# EAGLE design I2CRJ45X24PT (EAGLE 9.6.0)

## Sheet 1 of 4
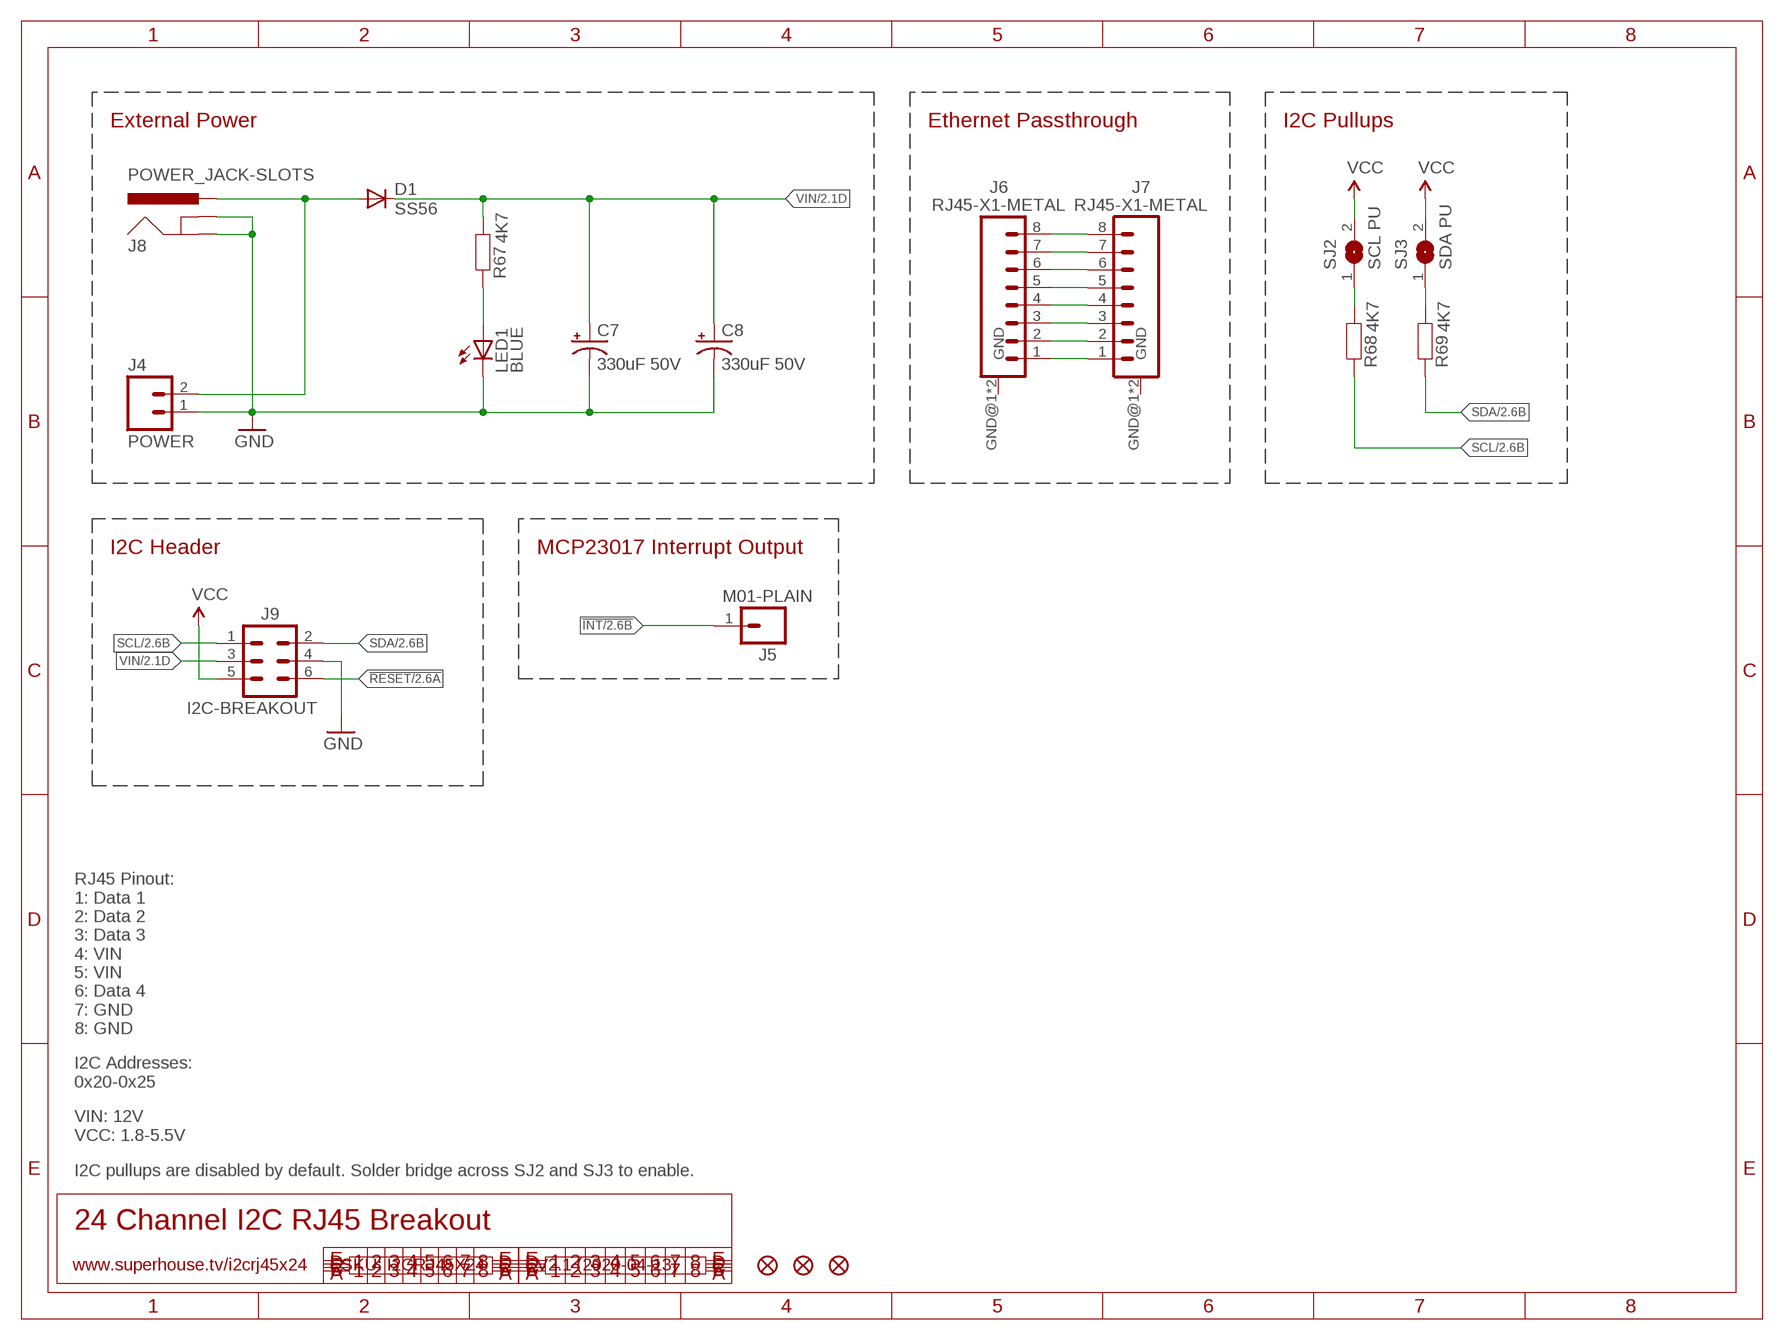
[diagram p0: schematic, sheet 1]

### Parts
C7  330uF 50V  CAP_POLG  [PANASONIC_G]
C8  330uF 50V  CAP_POLG  [PANASONIC_G]
D1  SS56  DIODESMA  [SMA-DIODE]
FID1  FIDUCIAL1X2.5  [FIDUCIAL-1X2.5]
FID2  FIDUCIAL1X2.5  [FIDUCIAL-1X2.5]
FID3  FIDUCIAL1X2.5  [FIDUCIAL-1X2.5]
J4  POWER  M02-SCREW-3.5MM  [SCREWTERMINAL-3.5MM-2]
J5  M01-PLAIN  [1X01]
J6  RJ45-X1-METAL  [RJ45-1X1]
J7  RJ45-X1-METAL  [RJ45-1X1]
J8  POWER_JACK-SLOTS  [POWER_JACK_SLOTS]
J9  I2C-BREAKOUT  M02X3-SHROUDED  [2X03-SHROUDED]
LED1  BLUE  LED3MM  [LED3MM]
R67  4K7  RESISTOR0603  [R0603]
R68  4K7  RESISTOR0603  [R0603]
R69  4K7  RESISTOR0603  [R0603]
SJ2  SCL PU  SJ-NORMAL  [SJ]
SJ3  SDA PU  SJ-NORMAL  [SJ]

### Nets
!INT: J5.1 ; also sheet 2,3,4
!RESET: J9.6 ; also sheet 2,3,4
GND: C7.- C8.- J4.1 J8.GND J8.GNDBREAK J9.4 LED1.K(C) ; also sheet 2,3,4
N$1: R68.2 SJ2.1
N$2: R69.2 SJ3.1
N$3: J6.1 J7.1
N$4: J6.2 J7.2
N$5: J6.3 J7.3
N$6: J6.4 J7.4
N$9: J6.5 J7.5
N$10: J6.6 J7.6
N$11: J6.7 J7.7
N$12: J6.8 J7.8
N$13: LED1.A R67.1
N$18: D1.A J4.2 J8.PWR
SCL: J9.1 R68.1 ; also sheet 2,3,4
SDA: J9.2 R69.1 ; also sheet 2,3,4
VCC: J9.5 SJ2.2 SJ3.2 ; also sheet 2,3,4
VIN: C7.+ C8.+ D1.C J9.3 R67.2 ; also sheet 2,3,4
Unconnected: J6.GND@1(GND) J6.GND@2(GND) J7.GND@1(GND) J7.GND@2(GND)

### Notes on the sheet
- External Power | Ethernet Passthrough | I2C Pullups
- I2C Header | MCP23017 Interrupt Output
- RJ45 Pinout:
  1: Data 1
  2: Data 2
  3: Data 3
  4: VIN
  5: VIN
  6: Data 4
  7: GND
  8: GND
- I2C Addresses:
  0x20-0x25
- VIN: 12V
  VCC: 1.8-5.5V
- I2C pullups are disabled by default. Solder bridge across SJ2 and SJ3 to enable.
- 24 Channel I2C RJ45 Breakout
- www.superhouse.tv/i2crj45x24 | SKU: I2CRJ45X24 | V2.1 (2020-04-13)

## Sheet 2 of 4
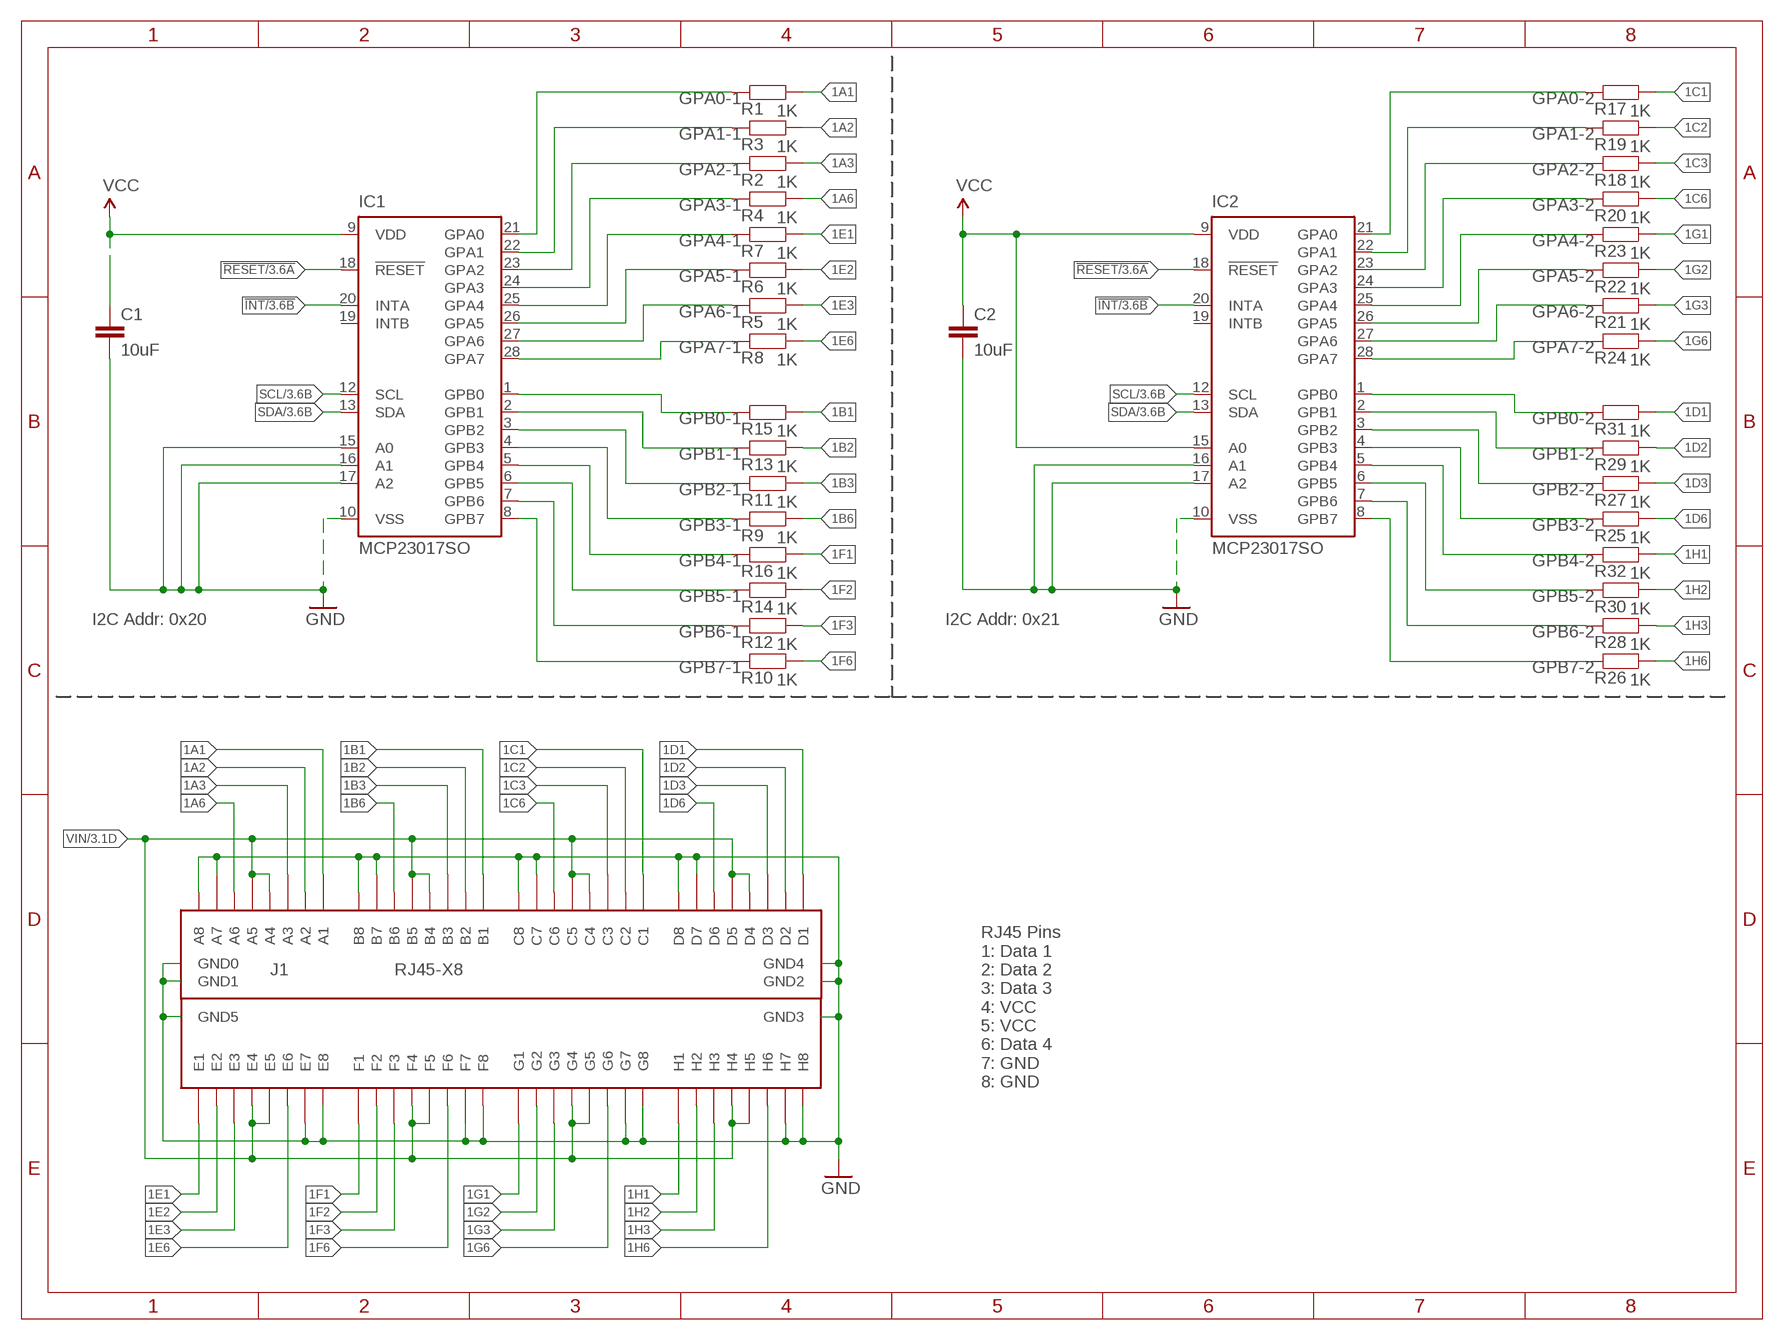
[diagram p1: schematic, sheet 2]

### Parts
C1  10uF  CAP0805  [C0805]
C2  10uF  CAP0805  [C0805]
IC1  MCP23017SO  [SO28W]
IC2  MCP23017SO  [SO28W]
J1  RJ45-X8  [RJ45-2X4]
R1  1K  RESISTOR0603  [R0603]
R2  1K  RESISTOR0603  [R0603]
R3  1K  RESISTOR0603  [R0603]
R4  1K  RESISTOR0603  [R0603]
R5  1K  RESISTOR0603  [R0603]
R6  1K  RESISTOR0603  [R0603]
R7  1K  RESISTOR0603  [R0603]
R8  1K  RESISTOR0603  [R0603]
R9  1K  RESISTOR0603  [R0603]
R10  1K  RESISTOR0603  [R0603]
R11  1K  RESISTOR0603  [R0603]
R12  1K  RESISTOR0603  [R0603]
R13  1K  RESISTOR0603  [R0603]
R14  1K  RESISTOR0603  [R0603]
R15  1K  RESISTOR0603  [R0603]
R16  1K  RESISTOR0603  [R0603]
R17  1K  RESISTOR0603  [R0603]
R18  1K  RESISTOR0603  [R0603]
R19  1K  RESISTOR0603  [R0603]
R20  1K  RESISTOR0603  [R0603]
R21  1K  RESISTOR0603  [R0603]
R22  1K  RESISTOR0603  [R0603]
R23  1K  RESISTOR0603  [R0603]
R24  1K  RESISTOR0603  [R0603]
R25  1K  RESISTOR0603  [R0603]
R26  1K  RESISTOR0603  [R0603]
R27  1K  RESISTOR0603  [R0603]
R28  1K  RESISTOR0603  [R0603]
R29  1K  RESISTOR0603  [R0603]
R30  1K  RESISTOR0603  [R0603]
R31  1K  RESISTOR0603  [R0603]
R32  1K  RESISTOR0603  [R0603]

### Nets
1A1: J1.A1 R1.2
1A2: J1.A2 R3.2
1A3: J1.A3 R2.2
1A6: J1.A6 R4.2
1B1: J1.B1 R15.2
1B2: J1.B2 R13.2
1B3: J1.B3 R11.2
1B6: J1.B6 R9.2
1C1: J1.C1 R17.2
1C2: J1.C2 R19.2
1C3: J1.C3 R18.2
1C6: J1.C6 R20.2
1D1: J1.D1 R31.2
1D2: J1.D2 R29.2
1D3: J1.D3 R27.2
1D6: J1.D6 R25.2
1E1: J1.E1 R7.2
1E2: J1.E2 R6.2
1E3: J1.E3 R5.2
1E6: J1.E6 R8.2
1F1: J1.F1 R16.2
1F2: J1.F2 R14.2
1F3: J1.F3 R12.2
1F6: J1.F6 R10.2
1G1: J1.G1 R23.2
1G2: J1.G2 R22.2
1G3: J1.G3 R21.2
1G6: J1.G6 R24.2
1H1: J1.H1 R32.2
1H2: J1.H2 R30.2
1H3: J1.H3 R28.2
1H6: J1.H6 R26.2
!INT: IC1.20(INTA) IC2.20(INTA) ; also sheet 1,3,4
!RESET: IC1.18(!RESET) IC2.18(!RESET) ; also sheet 1,3,4
GND: C1.2 C2.2 IC1.10(VSS) IC1.15(A0) IC1.16(A1) IC1.17(A2) IC2.10(VSS) IC2.16(A1) IC2.17(A2) J1.A7 J1.A8 J1.B7 J1.B8 J1.C7 J1.C8 J1.D7 J1.D8 J1.E7 J1.E8 J1.F7 J1.F8 J1.G7 J1.G8 J1.GND0 J1.GND1 J1.GND2 J1.GND3 J1.GND4 J1.GND5 J1.H7 J1.H8 ; also sheet 1,3,4
GPA0-1: IC1.21(GPA0) R1.1
GPA0-2: IC2.21(GPA0) R17.1
GPA1-1: IC1.22(GPA1) R3.1
GPA1-2: IC2.22(GPA1) R19.1
GPA2-1: IC1.23(GPA2) R2.1
GPA2-2: IC2.23(GPA2) R18.1
GPA3-1: IC1.24(GPA3) R4.1
GPA3-2: IC2.24(GPA3) R20.1
GPA4-1: IC1.25(GPA4) R7.1
GPA4-2: IC2.25(GPA4) R23.1
GPA5-1: IC1.26(GPA5) R6.1
GPA5-2: IC2.26(GPA5) R22.1
GPA6-1: IC1.27(GPA6) R5.1
GPA6-2: IC2.27(GPA6) R21.1
GPA7-1: IC1.28(GPA7) R8.1
GPA7-2: IC2.28(GPA7) R24.1
GPB0-1: IC1.1(GPB0) R15.1
GPB0-2: IC2.1(GPB0) R31.1
GPB1-1: IC1.2(GPB1) R13.1
GPB1-2: IC2.2(GPB1) R29.1
GPB2-1: IC1.3(GPB2) R11.1
GPB2-2: IC2.3(GPB2) R27.1
GPB3-1: IC1.4(GPB3) R9.1
GPB3-2: IC2.4(GPB3) R25.1
GPB4-1: IC1.5(GPB4) R16.1
GPB4-2: IC2.5(GPB4) R32.1
GPB5-1: IC1.6(GPB5) R14.1
GPB5-2: IC2.6(GPB5) R30.1
GPB6-1: IC1.7(GPB6) R12.1
GPB6-2: IC2.7(GPB6) R28.1
GPB7-1: IC1.8(GPB7) R10.1
GPB7-2: IC2.8(GPB7) R26.1
SCL: IC1.12(SCL) IC2.12(SCL) ; also sheet 1,3,4
SDA: IC1.13(SDA) IC2.13(SDA) ; also sheet 1,3,4
VCC: C1.1 C2.1 IC1.9(VDD) IC2.9(VDD) IC2.15(A0) ; also sheet 1,3,4
VIN: J1.A4 J1.A5 J1.B4 J1.B5 J1.C4 J1.C5 J1.D4 J1.D5 J1.E4 J1.E5 J1.F4 J1.F5 J1.G4 J1.G5 J1.H4 J1.H5 ; also sheet 1,3,4
Unconnected: IC1.19(INTB) IC2.19(INTB)

### Notes on the sheet
- I2C Addr: 0x20 | I2C Addr: 0x21
- RJ45 Pins
  1: Data 1
  2: Data 2
  3: Data 3
  4: VCC
  5: VCC
  6: Data 4
  7: GND
  8: GND

## Sheet 3 of 4
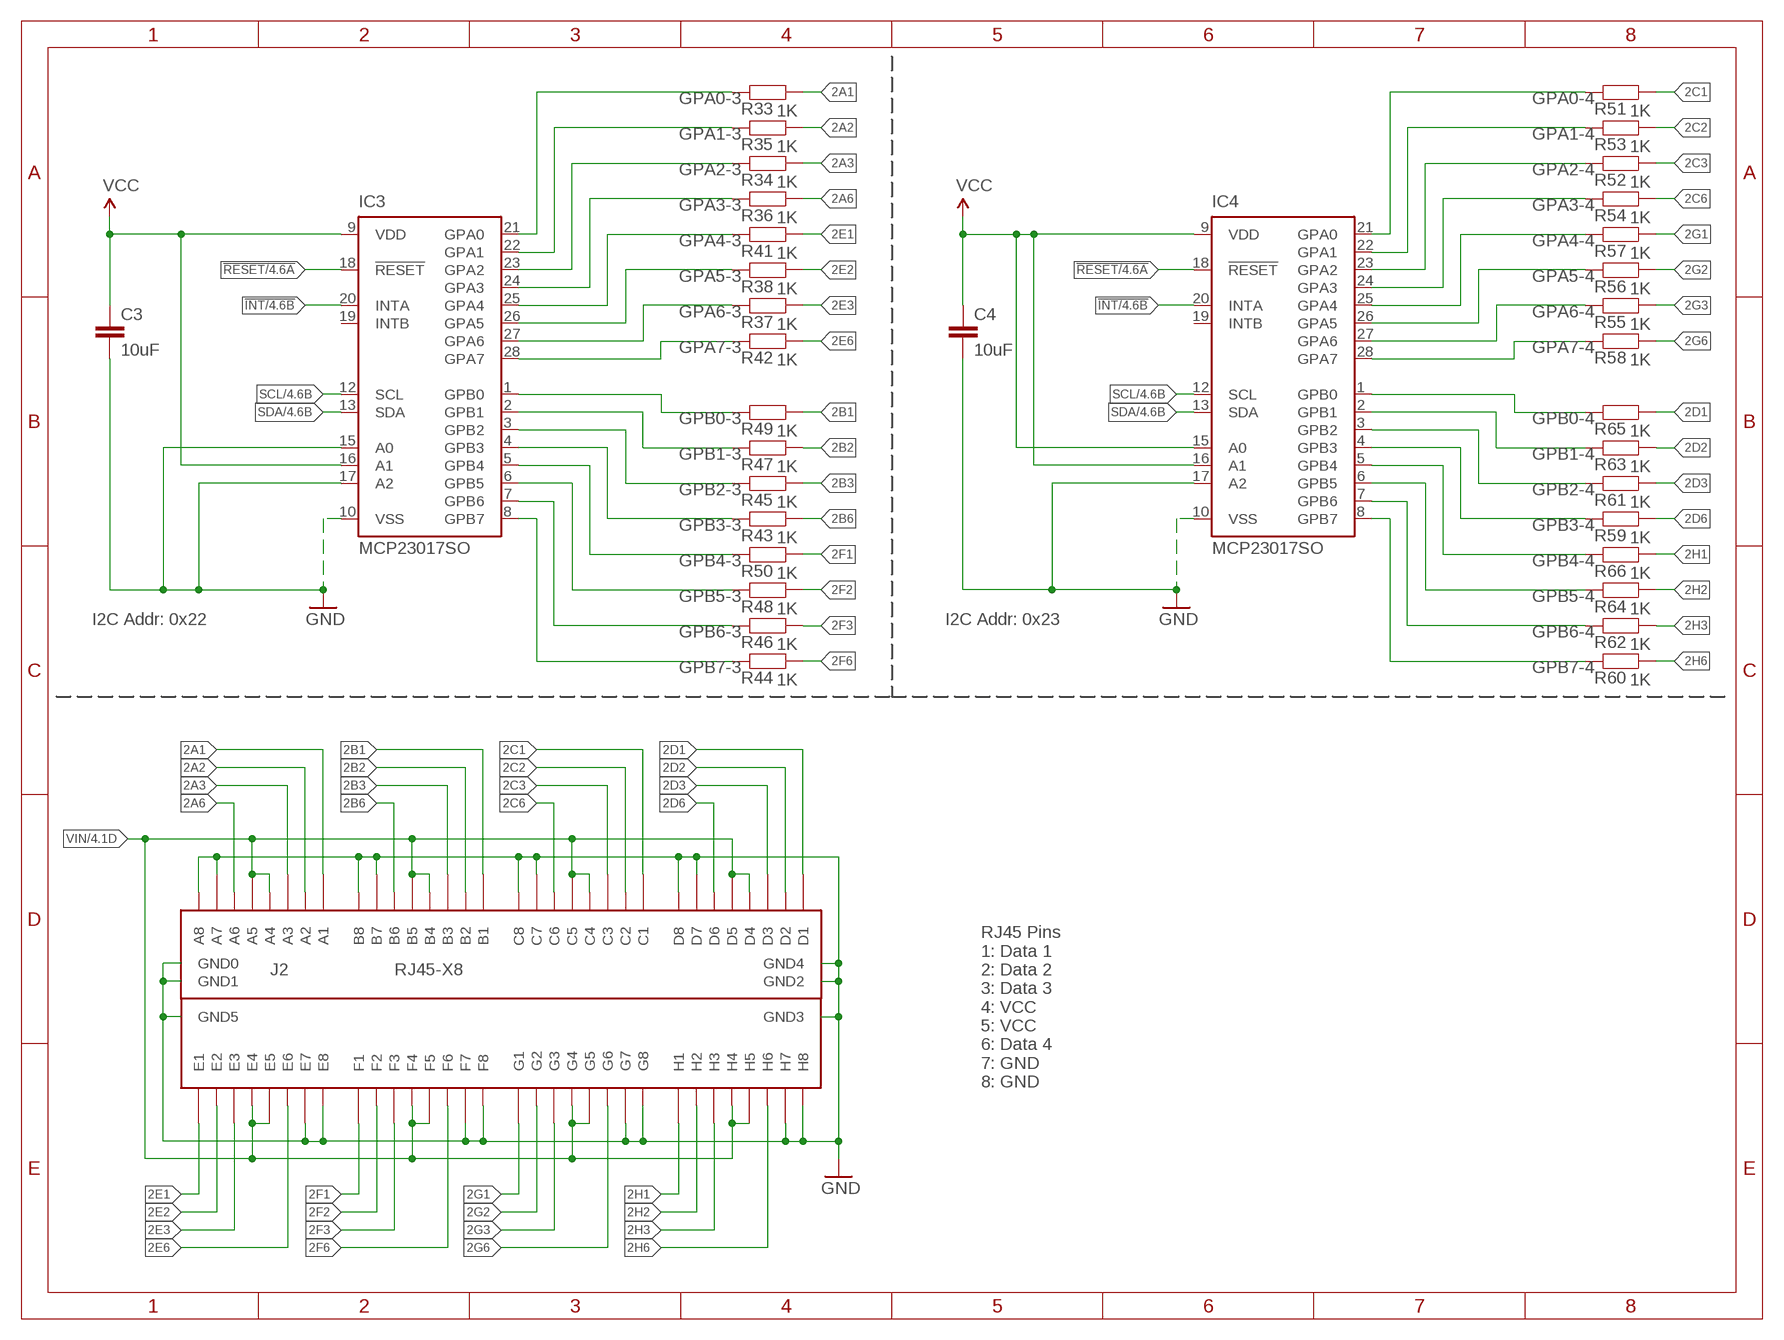
[diagram p2: schematic, sheet 3]

### Parts
C3  10uF  CAP0805  [C0805]
C4  10uF  CAP0805  [C0805]
IC3  MCP23017SO  [SO28W]
IC4  MCP23017SO  [SO28W]
J2  RJ45-X8  [RJ45-2X4]
R33  1K  RESISTOR0603  [R0603]
R34  1K  RESISTOR0603  [R0603]
R35  1K  RESISTOR0603  [R0603]
R36  1K  RESISTOR0603  [R0603]
R37  1K  RESISTOR0603  [R0603]
R38  1K  RESISTOR0603  [R0603]
R41  1K  RESISTOR0603  [R0603]
R42  1K  RESISTOR0603  [R0603]
R43  1K  RESISTOR0603  [R0603]
R44  1K  RESISTOR0603  [R0603]
R45  1K  RESISTOR0603  [R0603]
R46  1K  RESISTOR0603  [R0603]
R47  1K  RESISTOR0603  [R0603]
R48  1K  RESISTOR0603  [R0603]
R49  1K  RESISTOR0603  [R0603]
R50  1K  RESISTOR0603  [R0603]
R51  1K  RESISTOR0603  [R0603]
R52  1K  RESISTOR0603  [R0603]
R53  1K  RESISTOR0603  [R0603]
R54  1K  RESISTOR0603  [R0603]
R55  1K  RESISTOR0603  [R0603]
R56  1K  RESISTOR0603  [R0603]
R57  1K  RESISTOR0603  [R0603]
R58  1K  RESISTOR0603  [R0603]
R59  1K  RESISTOR0603  [R0603]
R60  1K  RESISTOR0603  [R0603]
R61  1K  RESISTOR0603  [R0603]
R62  1K  RESISTOR0603  [R0603]
R63  1K  RESISTOR0603  [R0603]
R64  1K  RESISTOR0603  [R0603]
R65  1K  RESISTOR0603  [R0603]
R66  1K  RESISTOR0603  [R0603]

### Nets
2A1: J2.A1 R33.2
2A2: J2.A2 R35.2
2A3: J2.A3 R34.2
2A6: J2.A6 R36.2
2B1: J2.B1 R49.2
2B2: J2.B2 R47.2
2B3: J2.B3 R45.2
2B6: J2.B6 R43.2
2C1: J2.C1 R51.2
2C2: J2.C2 R53.2
2C3: J2.C3 R52.2
2C6: J2.C6 R54.2
2D1: J2.D1 R65.2
2D2: J2.D2 R63.2
2D3: J2.D3 R61.2
2D6: J2.D6 R59.2
2E1: J2.E1 R41.2
2E2: J2.E2 R38.2
2E3: J2.E3 R37.2
2E6: J2.E6 R42.2
2F1: J2.F1 R50.2
2F2: J2.F2 R48.2
2F3: J2.F3 R46.2
2F6: J2.F6 R44.2
2G1: J2.G1 R57.2
2G2: J2.G2 R56.2
2G3: J2.G3 R55.2
2G6: J2.G6 R58.2
2H1: J2.H1 R66.2
2H2: J2.H2 R64.2
2H3: J2.H3 R62.2
2H6: J2.H6 R60.2
!INT: IC3.20(INTA) IC4.20(INTA) ; also sheet 1,2,4
!RESET: IC3.18(!RESET) IC4.18(!RESET) ; also sheet 1,2,4
GND: C3.2 C4.2 IC3.10(VSS) IC3.15(A0) IC3.17(A2) IC4.10(VSS) IC4.17(A2) J2.A7 J2.A8 J2.B7 J2.B8 J2.C7 J2.C8 J2.D7 J2.D8 J2.E7 J2.E8 J2.F7 J2.F8 J2.G7 J2.G8 J2.GND0 J2.GND1 J2.GND2 J2.GND3 J2.GND4 J2.GND5 J2.H7 J2.H8 ; also sheet 1,2,4
GPA0-3: IC3.21(GPA0) R33.1
GPA0-4: IC4.21(GPA0) R51.1
GPA1-3: IC3.22(GPA1) R35.1
GPA1-4: IC4.22(GPA1) R53.1
GPA2-3: IC3.23(GPA2) R34.1
GPA2-4: IC4.23(GPA2) R52.1
GPA3-3: IC3.24(GPA3) R36.1
GPA3-4: IC4.24(GPA3) R54.1
GPA4-3: IC3.25(GPA4) R41.1
GPA4-4: IC4.25(GPA4) R57.1
GPA5-3: IC3.26(GPA5) R38.1
GPA5-4: IC4.26(GPA5) R56.1
GPA6-3: IC3.27(GPA6) R37.1
GPA6-4: IC4.27(GPA6) R55.1
GPA7-3: IC3.28(GPA7) R42.1
GPA7-4: IC4.28(GPA7) R58.1
GPB0-3: IC3.1(GPB0) R49.1
GPB0-4: IC4.1(GPB0) R65.1
GPB1-3: IC3.2(GPB1) R47.1
GPB1-4: IC4.2(GPB1) R63.1
GPB2-3: IC3.3(GPB2) R45.1
GPB2-4: IC4.3(GPB2) R61.1
GPB3-3: IC3.4(GPB3) R43.1
GPB3-4: IC4.4(GPB3) R59.1
GPB4-3: IC3.5(GPB4) R50.1
GPB4-4: IC4.5(GPB4) R66.1
GPB5-3: IC3.6(GPB5) R48.1
GPB5-4: IC4.6(GPB5) R64.1
GPB6-3: IC3.7(GPB6) R46.1
GPB6-4: IC4.7(GPB6) R62.1
GPB7-3: IC3.8(GPB7) R44.1
GPB7-4: IC4.8(GPB7) R60.1
SCL: IC3.12(SCL) IC4.12(SCL) ; also sheet 1,2,4
SDA: IC3.13(SDA) IC4.13(SDA) ; also sheet 1,2,4
VCC: C3.1 C4.1 IC3.9(VDD) IC3.16(A1) IC4.9(VDD) IC4.15(A0) IC4.16(A1) ; also sheet 1,2,4
VIN: J2.A4 J2.A5 J2.B4 J2.B5 J2.C4 J2.C5 J2.D4 J2.D5 J2.E4 J2.E5 J2.F4 J2.F5 J2.G4 J2.G5 J2.H4 J2.H5 ; also sheet 1,2,4
Unconnected: IC3.19(INTB) IC4.19(INTB)

### Notes on the sheet
- I2C Addr: 0x22 | I2C Addr: 0x23
- RJ45 Pins
  1: Data 1
  2: Data 2
  3: Data 3
  4: VCC
  5: VCC
  6: Data 4
  7: GND
  8: GND

## Sheet 4 of 4
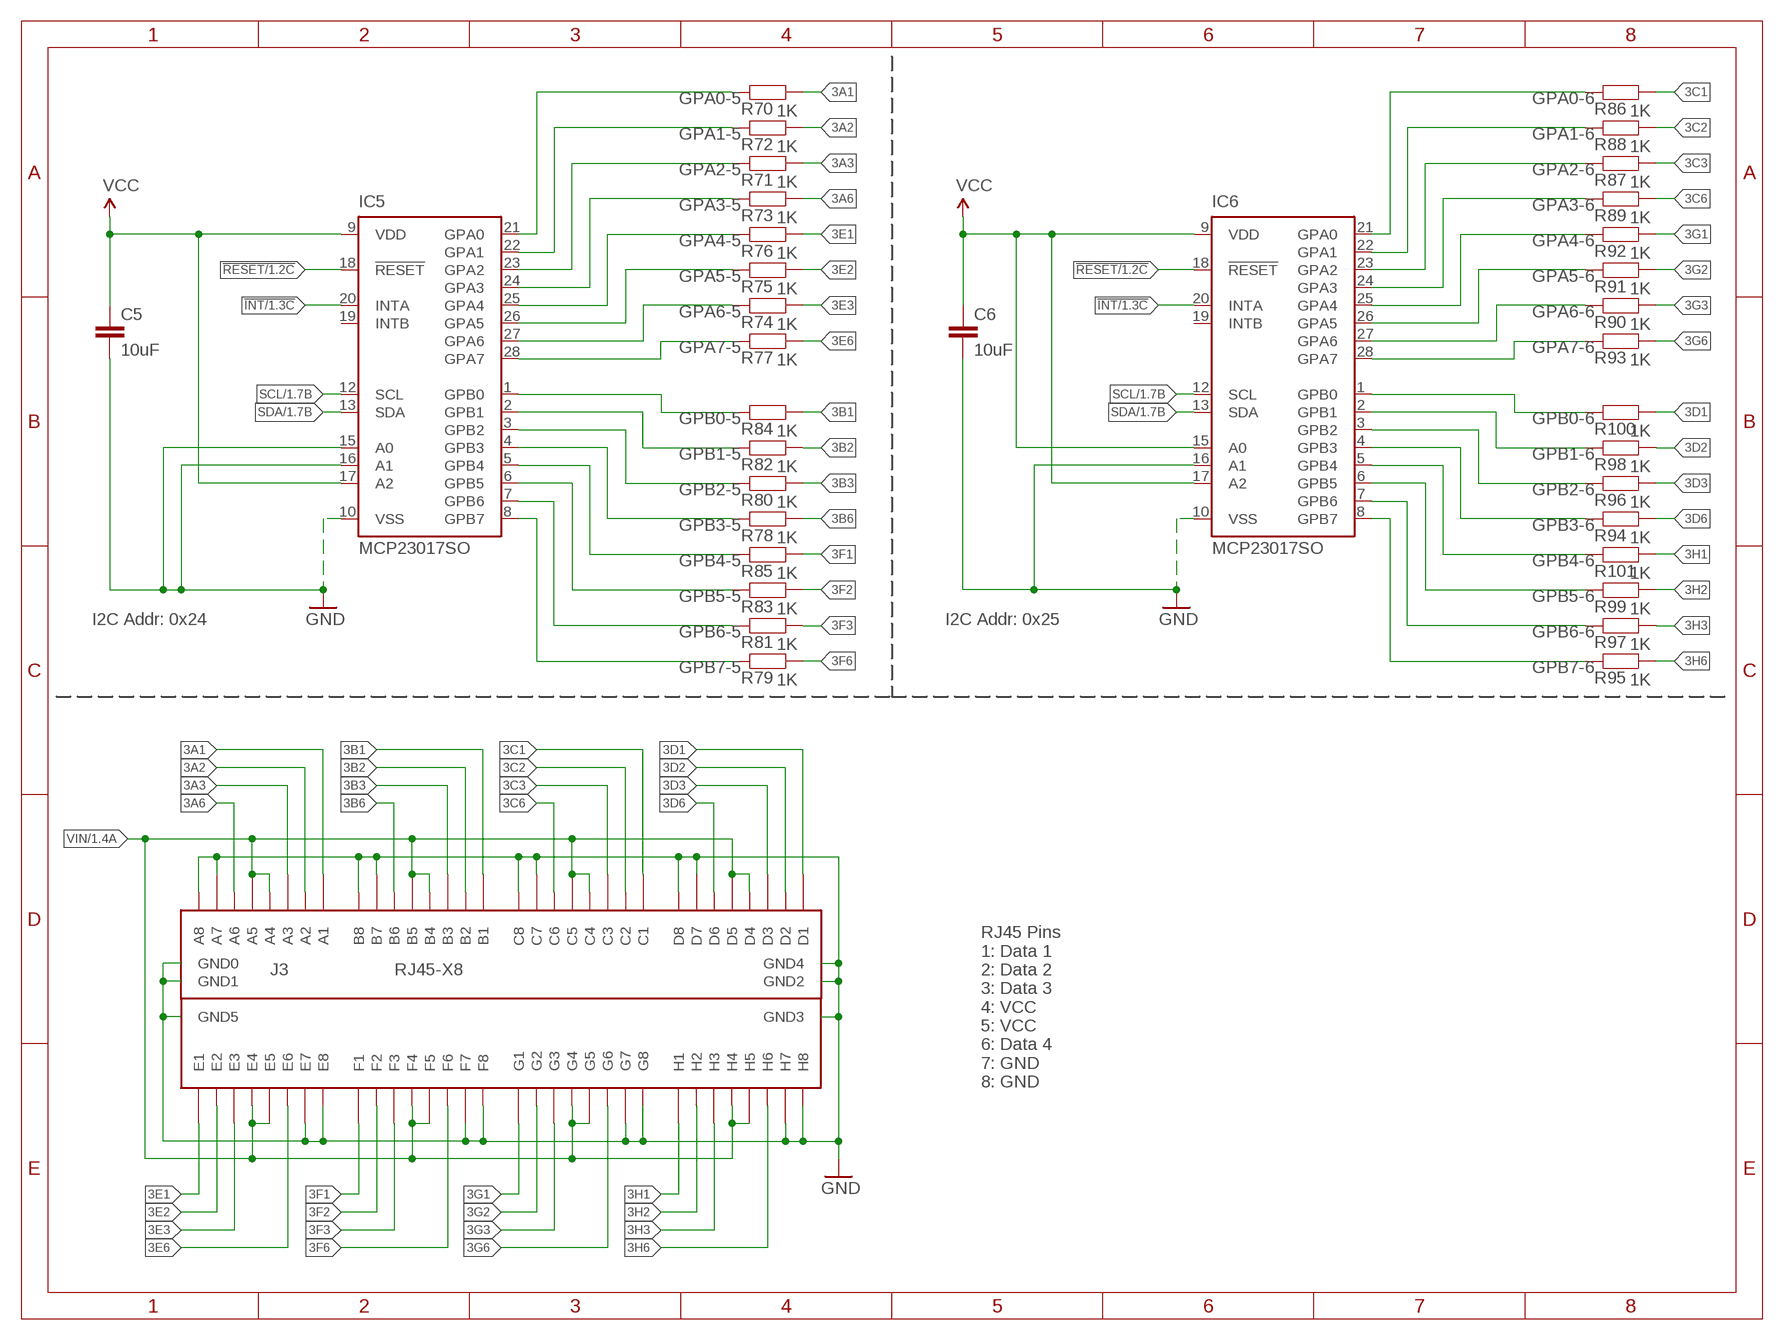
[diagram p3: schematic, sheet 4]

### Parts
C5  10uF  CAP0805  [C0805]
C6  10uF  CAP0805  [C0805]
IC5  MCP23017SO  [SO28W]
IC6  MCP23017SO  [SO28W]
J3  RJ45-X8  [RJ45-2X4]
R70  1K  RESISTOR0603  [R0603]
R71  1K  RESISTOR0603  [R0603]
R72  1K  RESISTOR0603  [R0603]
R73  1K  RESISTOR0603  [R0603]
R74  1K  RESISTOR0603  [R0603]
R75  1K  RESISTOR0603  [R0603]
R76  1K  RESISTOR0603  [R0603]
R77  1K  RESISTOR0603  [R0603]
R78  1K  RESISTOR0603  [R0603]
R79  1K  RESISTOR0603  [R0603]
R80  1K  RESISTOR0603  [R0603]
R81  1K  RESISTOR0603  [R0603]
R82  1K  RESISTOR0603  [R0603]
R83  1K  RESISTOR0603  [R0603]
R84  1K  RESISTOR0603  [R0603]
R85  1K  RESISTOR0603  [R0603]
R86  1K  RESISTOR0603  [R0603]
R87  1K  RESISTOR0603  [R0603]
R88  1K  RESISTOR0603  [R0603]
R89  1K  RESISTOR0603  [R0603]
R90  1K  RESISTOR0603  [R0603]
R91  1K  RESISTOR0603  [R0603]
R92  1K  RESISTOR0603  [R0603]
R93  1K  RESISTOR0603  [R0603]
R94  1K  RESISTOR0603  [R0603]
R95  1K  RESISTOR0603  [R0603]
R96  1K  RESISTOR0603  [R0603]
R97  1K  RESISTOR0603  [R0603]
R98  1K  RESISTOR0603  [R0603]
R99  1K  RESISTOR0603  [R0603]
R100  1K  RESISTOR0603  [R0603]
R101  1K  RESISTOR0603  [R0603]

### Nets
3A1: J3.A1 R70.2
3A2: J3.A2 R72.2
3A3: J3.A3 R71.2
3A6: J3.A6 R73.2
3B1: J3.B1 R84.2
3B2: J3.B2 R82.2
3B3: J3.B3 R80.2
3B6: J3.B6 R78.2
3C1: J3.C1 R86.2
3C2: J3.C2 R88.2
3C3: J3.C3 R87.2
3C6: J3.C6 R89.2
3D1: J3.D1 R100.2
3D2: J3.D2 R98.2
3D3: J3.D3 R96.2
3D6: J3.D6 R94.2
3E1: J3.E1 R76.2
3E2: J3.E2 R75.2
3E3: J3.E3 R74.2
3E6: J3.E6 R77.2
3F1: J3.F1 R85.2
3F2: J3.F2 R83.2
3F3: J3.F3 R81.2
3F6: J3.F6 R79.2
3G1: J3.G1 R92.2
3G2: J3.G2 R91.2
3G3: J3.G3 R90.2
3G6: J3.G6 R93.2
3H1: J3.H1 R101.2
3H2: J3.H2 R99.2
3H3: J3.H3 R97.2
3H6: J3.H6 R95.2
!INT: IC5.20(INTA) IC6.20(INTA) ; also sheet 1,2,3
!RESET: IC5.18(!RESET) IC6.18(!RESET) ; also sheet 1,2,3
GND: C5.2 C6.2 IC5.10(VSS) IC5.15(A0) IC5.16(A1) IC6.10(VSS) IC6.16(A1) J3.A7 J3.A8 J3.B7 J3.B8 J3.C7 J3.C8 J3.D7 J3.D8 J3.E7 J3.E8 J3.F7 J3.F8 J3.G7 J3.G8 J3.GND0 J3.GND1 J3.GND2 J3.GND3 J3.GND4 J3.GND5 J3.H7 J3.H8 ; also sheet 1,2,3
GPA0-5: IC5.21(GPA0) R70.1
GPA0-6: IC6.21(GPA0) R86.1
GPA1-5: IC5.22(GPA1) R72.1
GPA1-6: IC6.22(GPA1) R88.1
GPA2-5: IC5.23(GPA2) R71.1
GPA2-6: IC6.23(GPA2) R87.1
GPA3-5: IC5.24(GPA3) R73.1
GPA3-6: IC6.24(GPA3) R89.1
GPA4-5: IC5.25(GPA4) R76.1
GPA4-6: IC6.25(GPA4) R92.1
GPA5-5: IC5.26(GPA5) R75.1
GPA5-6: IC6.26(GPA5) R91.1
GPA6-5: IC5.27(GPA6) R74.1
GPA6-6: IC6.27(GPA6) R90.1
GPA7-5: IC5.28(GPA7) R77.1
GPA7-6: IC6.28(GPA7) R93.1
GPB0-5: IC5.1(GPB0) R84.1
GPB0-6: IC6.1(GPB0) R100.1
GPB1-5: IC5.2(GPB1) R82.1
GPB1-6: IC6.2(GPB1) R98.1
GPB2-5: IC5.3(GPB2) R80.1
GPB2-6: IC6.3(GPB2) R96.1
GPB3-5: IC5.4(GPB3) R78.1
GPB3-6: IC6.4(GPB3) R94.1
GPB4-5: IC5.5(GPB4) R85.1
GPB4-6: IC6.5(GPB4) R101.1
GPB5-5: IC5.6(GPB5) R83.1
GPB5-6: IC6.6(GPB5) R99.1
GPB6-5: IC5.7(GPB6) R81.1
GPB6-6: IC6.7(GPB6) R97.1
GPB7-5: IC5.8(GPB7) R79.1
GPB7-6: IC6.8(GPB7) R95.1
SCL: IC5.12(SCL) IC6.12(SCL) ; also sheet 1,2,3
SDA: IC5.13(SDA) IC6.13(SDA) ; also sheet 1,2,3
VCC: C5.1 C6.1 IC5.9(VDD) IC5.17(A2) IC6.9(VDD) IC6.15(A0) IC6.17(A2) ; also sheet 1,2,3
VIN: J3.A4 J3.A5 J3.B4 J3.B5 J3.C4 J3.C5 J3.D4 J3.D5 J3.E4 J3.E5 J3.F4 J3.F5 J3.G4 J3.G5 J3.H4 J3.H5 ; also sheet 1,2,3
Unconnected: IC5.19(INTB) IC6.19(INTB)

### Notes on the sheet
- I2C Addr: 0x24 | I2C Addr: 0x25
- RJ45 Pins
  1: Data 1
  2: Data 2
  3: Data 3
  4: VCC
  5: VCC
  6: Data 4
  7: GND
  8: GND

## Library data of the parts
C1-C6 = SuperHouse-DiscreteSemi:CAP: Capacitor Standard ceramic capacitor
C7 C8 = SuperHouse-DiscreteSemi:CAP_POL: Capacitor Polarized These are standard SMD and PTH capacitors. Normally 10uF, 47uF, and 100uF in electrolytic and tantalum varieties. Always verify the external diameter of the through hole cap, it varies with capacity, voltage, and manufacturer. The EIA devices should be standard.
D1 = SuperHouse-DiscreteSemi:DIODE: Diode Standard reverse protection diodes and small signal diodes. SMA package can handle up to about 1A. SOD-323 can handle about 200mA.
FID1-FID3 = SuperHouse-Symbols:FIDUCIAL: Fiducial Alignment Points Various fiducial points for machine vision alignment.
IC1-IC6 = SuperHouse-ICs:MCP23017: http://ww1.microchip.com/downloads/en/DeviceDoc/21952a.pdf Source: http://ww1.microchip.com/downloads/en/DeviceDoc/21952a.pdf
J1-J3 = SuperHouse-Connectors:RJ45-X8: 8-way RJ45 socket, PCB mount. 2 rows of 4.
J4 = SuperHouse-Connectors:M02: 2-way header Standard 1x2 header, and screw terminal variations
J5 = SuperHouse-Connectors:M01: 1-way header Standard 1x1 header
J6 J7 = SuperHouse-Connectors:RJ45-X1: RJ45 socket with GND connection
J8 = SuperHouse-Connectors:POWER_JACK: Power Jack This is the standard 5.5mm barrel jack for power. The PTH is the most common, proven, reliable, footprint. All others are experimental. The Slot footprint only works if the mill layer is transmitted to the PCB fab house so be warned. Spark Fun Electronics SKU : PRT-00119. Mating wall wart : TOL-00298 (and others)
J9 = SuperHouse-Connectors:M02X3: 0.1" header, 2x3 (6-way)
LED1 = SuperHouse-LEDs:LED: LEDs Standard schematic elements and footprints for 5mm, 3mm, 1206, and 0603 sized LEDs. 5mm - Spark Fun Electronics SKU : COM-00529 (and others)
R1-R38 R41-R101 = SuperHouse-DiscreteSemi:RESISTOR: Resistor Standard resistors.
SJ2 SJ3 = SuperHouse-Jumpers:SJ: SMD solder jumper, normally-open. Add solder to close the connection.

## Board
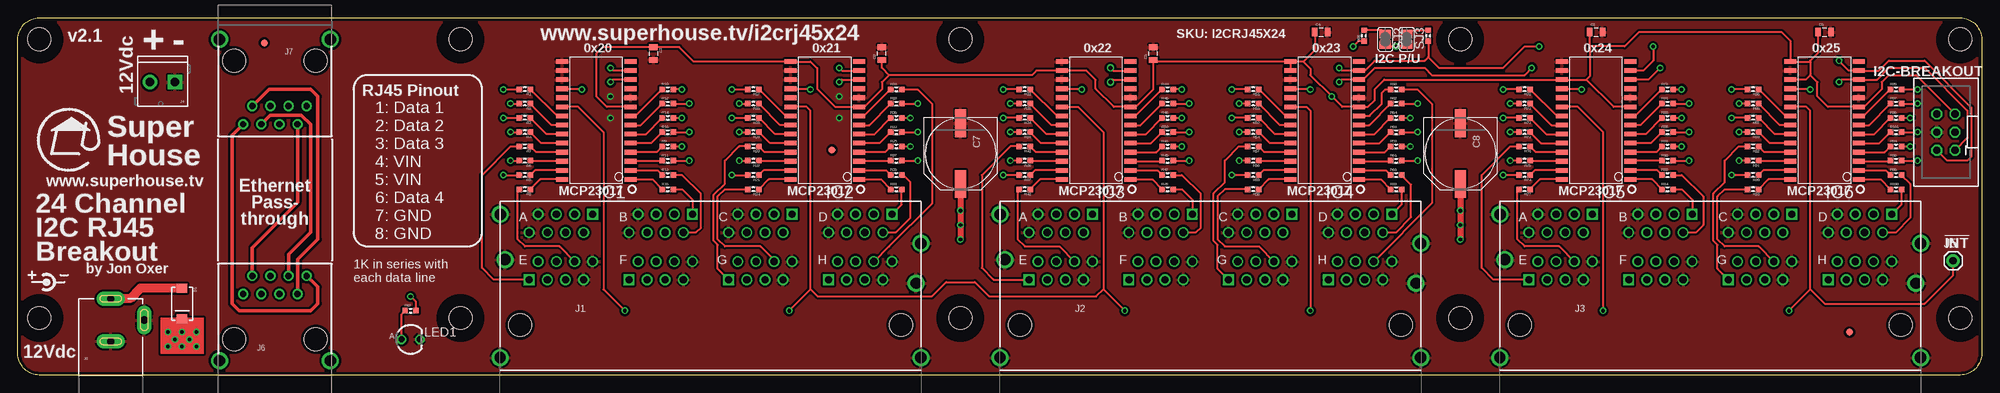
[diagram p4: board, top side]
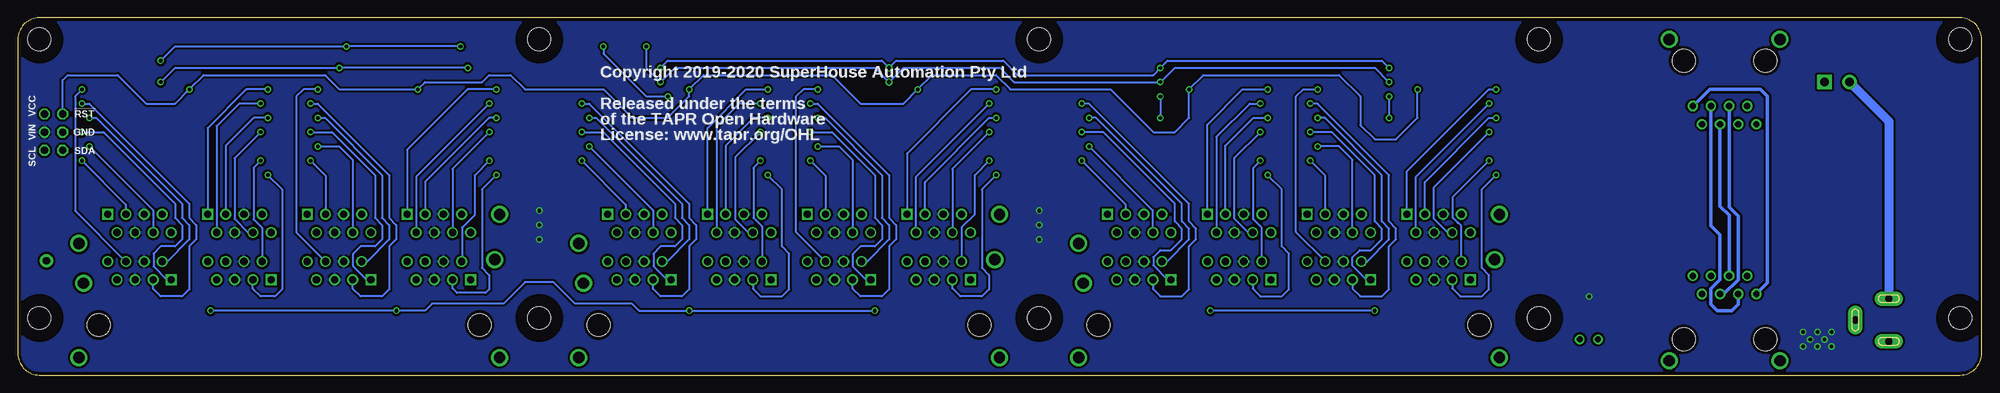
[diagram p5: board, bottom side, seen from below]

Size 275 x 50 mm. Coordinates in mm from the lower left corner, seen from the top.
Outline: 3,0 arc-90 0,3 0,47 arc-90 3,50 272,50 arc-90 275,47 275,3 arc-90 272,0 3,0
Copper layers (1*16): Top 0.035mm / dielectric 1.5mm / Bottom 0.035mm
Design rules "default *": minimum track width 10mil, minimum drill 0.5mm, track to track 12mil, track to pad 12mil, pad to pad 12mil, via to via 12mil, smd to smd 8mil, copper to edge 18mil, drill to drill 8mil, minimum pad ring 10mil, minimum via ring 8mil, stop-mask expansion 4mil, vias tented up to drill 25mil, thermal gap 10mil
Holes 3.2 mm at 3,8 202,8 202,47 3,47 132,8 132,47 62,8 272,8 272,47 62,47
tRestrict: area -0.2,43.8 to 6.2,50.2; area -0.2,4.8 to 6.2,11.2; area 128.8,4.8 to 135.2,11.2; area 198.8,4.8 to 205.2,11.2; area 198.8,43.8 to 205.2,50.2; area 128.8,43.8 to 135.2,50.2; area 58.8,4.8 to 65.2,11.2; area 268.8,4.8 to 275.2,11.2; area 268.8,43.8 to 275.2,50.2; area 58.8,43.8 to 65.2,50.2
bRestrict: area -0.2,43.8 to 6.2,50.2; area 128.8,43.8 to 135.2,50.2; area 198.8,43.8 to 205.2,50.2; area 128.8,4.8 to 135.2,11.2; area 198.8,4.8 to 205.2,11.2; area -0.2,4.8 to 6.2,11.2; area 58.8,4.8 to 65.2,11.2; area 268.8,4.8 to 275.2,11.2; area 268.8,43.8 to 275.2,50.2; area 58.8,43.8 to 65.2,50.2

### Footprints (pad centres in the part's own frame; a part is rotated, then mirrored left to right if it is on the bottom)
C0805 = smd 0.8 x 1.2: 1 -0.9,0; 2 0.9,0
PANASONIC_G = smd 3.9 x 1.6: + 4.25,0; - -4.25,0
SMA-DIODE = smd 1.27 x 1.47: A -2.15,0; C 2.15,0
FIDUCIAL-1X2.5 = smd 1 x 1: 1 0,0
SO28W = smd 0.65 x 1.7: 1 -7.62,-4.78; 2 -6.35,-4.78; 3 -5.08,-4.78; 4 -3.81,-4.78; 5 -2.54,-4.78; 6 -1.27,-4.78; 7 0,-4.78; 8 1.27,-4.78; 9 2.54,-4.78; 10 3.81,-4.78; 11 5.08,-4.78; 12 6.35,-4.78; 13 7.62,-4.78; 14 8.89,-4.78; 15 8.89,4.78; 16 7.62,4.78; 17 6.35,4.78; 18 5.08,4.78; 19 3.81,4.78; 20 2.54,4.78; 21 1.27,4.78; 22 0,4.78; 23 -1.27,4.78; 24 -2.54,4.78; 25 -3.81,4.78; 26 -5.08,4.78; 27 -6.35,4.78; 28 -7.62,4.78
RJ45-2X4 = drill 1 square: A1 -16.51,15.49; B1 -2.54,15.49; C1 11.43,15.49; D1 25.4,15.49; E1 -25.4,6.35; F1 -11.43,6.35; G1 2.54,6.35; H1 16.51,6.35 | drill 1: A2 -17.78,12.95; A3 -19.05,15.49; A4 -20.32,12.95; A5 -21.59,15.49; A6 -22.86,12.95; A7 -24.13,15.49; A8 -25.4,12.95; B2 -3.81,12.95; B3 -5.08,15.49; B4 -6.35,12.95; B5 -7.62,15.49; B6 -8.89,12.95; B7 -10.16,15.49; B8 -11.43,12.95; C2 10.16,12.95; C3 8.89,15.49; C4 7.62,12.95; C5 6.35,15.49; C6 5.08,12.95; C7 3.81,15.49; C8 2.54,12.95; D2 24.13,12.95; D3 22.86,15.49; D4 21.59,12.95; D5 20.32,15.49; D6 19.05,12.95; D7 17.78,15.49; D8 16.51,12.95; E2 -24.13,8.89; E3 -22.86,6.35; E4 -21.59,8.89; E5 -20.32,6.35; E6 -19.05,8.89; E7 -17.78,6.35; E8 -16.51,8.89; F2 -10.16,8.89; F3 -8.89,6.35; F4 -7.62,8.89; F5 -6.35,6.35; F6 -5.08,8.89; F7 -3.81,6.35; F8 -2.54,8.89; G2 3.81,8.89; G3 5.08,6.35; G4 6.35,8.89; G5 7.62,6.35; G6 8.89,8.89; G7 10.16,6.35; G8 11.43,8.89; H2 17.78,8.89; H3 19.05,6.35; H4 20.32,8.89; H5 21.59,6.35; H6 22.86,8.89; H7 24.13,6.35; H8 25.4,8.89 | drill 1.6: GND0 29.464,-4.572; GND1 28.79,5.85; GND2 -29.46,15.5; GND3 -28.79,9.15; GND4 -29.464,-4.572; GND5 29.46,11.43 | hole 3.2: 26.67,0; -26.67,0
SCREWTERMINAL-3.5MM-2 = drill 1.2 pad 2.032 square: 1 0,0 | drill 1.2 pad 2.032: 2 3.5,0
1X01 = drill 1.016 pad 1.88: 1 0,0
RJ45-1X1 = drill 0.9 pad 1.422: 1 -4.445,6.35; 2 -3.175,8.89; 3 -1.905,6.35; 4 -0.635,8.89; 5 0.635,6.35; 6 1.905,8.89; 7 3.175,6.35; 8 4.445,8.89 | drill 1.6: GND@1 -7.75,-3; GND@2 7.75,-3 | hole 3.2: -5.715,0; 5.715,0
POWER_JACK_SLOTS = drill 1 pad 2 long: GND 0,7.7; GNDBREAK 4.7,10.7; PWR 0,13.7
2X03-SHROUDED = drill 1.016 octagon: 1 -1.27,2.54; 2 1.27,2.54; 3 -1.27,0; 4 1.27,0; 5 -1.27,-2.54; 6 1.27,-2.54
LED3MM = drill 0.813: A -1.27,0; K 1.27,0
R0603 = smd 0.762 x 0.762: 1 -0.762,0; 2 0.762,0
SJ = smd 1.168 x 1.6: 1 -0.762,0; 2 0.762,0

### Placement (x,y rotation side)
C1  89,45 270 top
C2  121,45 90 top
C3  159,45 90 top
C4  182.5,48 0 top
C5  221,48 0 top
C6  253,48 0 top
C7  132,31 270 top
C8  202,31 270 top
D1  23,10 270 top
FID1  34.5,46.5 0 top
FID2  256.5,6 0 top
FID3  114,31.5 0 top
IC1  81,35 90 top
IC2  113,35 90 top
IC3  151,35 90 top
IC4  183,35 90 top
IC5  221,35 90 top
IC6  253,35 90 top
J1  97,7 0 top
J2  167,7 0 top
J3  237,7 0 top
J4  22,41 180 top
J5  271,16 0 top
J6  36,5 0 top
J7  36,44 180 top
J8  13,-3 0 top
J9  270,34 180 top
LED1  55,5 0 top
R1  71,40 180 top
R2  71,36 180 top
R3  71,38 180 top
R4  71,34 180 top
R5  71,28 180 top
R6  71,30 180 top
R7  71,32 180 top
R8  71,26 180 top
R9  91,32 0 top
R10  91,40 0 top
R11  91,30 0 top
R12  91,38 0 top
R13  91,28 0 top
R14  91,36 0 top
R15  91,26 0 top
R16  91,34 0 top
R17  103,40 180 top
R18  103,36 180 top
R19  103,38 180 top
R20  103,34 180 top
R21  103,28 180 top
R22  103,30 180 top
R23  103,32 180 top
R24  103,26 180 top
R25  123,32 0 top
R26  123,40 0 top
R27  123,30 0 top
R28  123,38 0 top
R29  123,28 0 top
R30  123,36 0 top
R31  123,26 0 top
R32  123,34 0 top
R33  141,40 180 top
R34  141,36 180 top
R35  141,38 180 top
R36  141,34 180 top
R37  141,28 180 top
R38  141,30 180 top
R41  141,32 180 top
R42  141,26 180 top
R43  161,32 0 top
R44  161,40 0 top
R45  161,30 0 top
R46  161,38 0 top
R47  161,28 0 top
R48  161,36 0 top
R49  161,26 0 top
R50  161,34 0 top
R51  173,40 180 top
R52  173,36 180 top
R53  173,38 180 top
R54  173,34 180 top
R55  173,28 180 top
R56  173,30 180 top
R57  173,32 180 top
R58  173,26 180 top
R59  193,32 0 top
R60  193,40 0 top
R61  193,30 0 top
R62  193,38 0 top
R63  193,28 0 top
R64  193,36 0 top
R65  193,26 0 top
R66  193,34 0 top
R67  55,9 0 top
R68  188.5,47.5 90 top
R69  197.5,47.5 90 top
R70  211,40 180 top
R71  211,36 180 top
R72  211,38 180 top
R73  211,34 180 top
R74  211,28 180 top
R75  211,30 180 top
R76  211,32 180 top
R77  211,26 180 top
R78  231,32 0 top
R79  231,40 0 top
R80  231,30 0 top
R81  231,38 0 top
R82  231,28 0 top
R83  231,36 0 top
R84  231,26 0 top
R85  231,34 0 top
R86  243,40 180 top
R87  243,36 180 top
R88  243,38 180 top
R89  243,34 180 top
R90  243,28 180 top
R91  243,30 180 top
R92  243,32 180 top
R93  243,26 180 top
R94  263,32 0 top
R95  263,40 0 top
R96  263,30 0 top
R97  263,38 0 top
R98  263,28 0 top
R99  263,36 0 top
R100  263,26 0 top
R101  263,34 0 top
SJ2  191.5,47 270 top
SJ3  194.5,47 270 top

### Tracks (layer width: path | path; a pad name or v marks a point on that pad's centre or on a via)
1A1  (via drill 0.5)
  Top 0.254: v68,40 R1.2
  Bottom 0.254: J1.A1 80.49,28.51 69,40 v68,40
1A2  (via drill 0.5)
  Top 0.254: v69,38 R3.2
  Bottom 0.254: J1.A2 79.22,27.78 v69,38
1A3  (via drill 0.5)
  Top 0.254: v68,36 R2.2
  Bottom 0.254: J1.A3 78,22.54 78,27 69,36 v68,36
1A6  (via drill 0.5)
  Top 0.254: v69,34 R4.2
  Bottom 0.254: v69,34 76.76,26.24 76.76,21.97 74.75,19.95 J1.A6
1B1
  Top 0.254: R15.2 93,26 94.46,24.54 J1.B1
1B2
  Top 0.254: J1.B2 93.24,20 95,20 95.65,20.65 95.65,25.35 93,28 R13.2
1B3  (via drill 0.5)
  Top 0.254: R11.2 v94,30
  Bottom 0.254: J1.B3 91.92,27.92 v94,30
1B6  (via drill 0.5)
  Top 0.254: R9.2 v93,32
  Bottom 0.254: J1.B6 88.11,30.11 90,32 v93,32
1C1  (via drill 0.5)
  Top 0.254: v100,40 R17.2
  Bottom 0.254: J1.C1 108.43,35.07 103.5,40 v100,40
1C2  (via drill 0.5)
  Top 0.254: v101,38 R19.2
  Bottom 0.254: J1.C2 107.18,19.97 107.18,33.32 102.5,38 v101,38
1C3  (via drill 0.5)
  Top 0.254: v100,36 R18.2
  Bottom 0.254: J1.C3 105.9,32.1 102,36 v100,36
1C6  (via drill 0.5)
  Top 0.254: v101,34 R20.2
  Bottom 0.254: v101,34 104.6,30.4 104.6,21.87 102.69,19.95 J1.C6
1D1
  Top 0.254: J1.D1 123.76,23.85 R31.2
1D2
  Top 0.254: J1.D2 121.18,20 123,20 125,22 125,27 124,28 R29.2
1D3  (via drill 0.5)
  Top 0.254: R27.2 v126,30
  Bottom 0.254: J1.D3 119.86,23.86 v126,30
1D6  (via drill 0.5)
  Top 0.254: R25.2 v125,32
  Bottom 0.254: J1.D6 116.1,20 116.1,23.1 v125,32
1E1
  Top 0.254: J1.E1 66.65,13.35 65,15 65,28 69,32 R7.2
1E2  (via drill 0.5)
  Top 0.254: v69,30 R6.2
  Bottom 0.254: J1.E2 72.87,20.87 73.3,21.3 73.36,21.3 74.06,22 74.06,24.94 v69,30
1E3  (via drill 0.5)
  Top 0.254: v68,28 R5.2
  Bottom 0.254: J1.E3 74.14,12.14 73,11 70,11 69,12 69,14 70,15 70,26 v68,28
1E6
  Top 0.254: J1.E6 75.84,18 71,18 70,19 70,25.76 R8.2
1F1  (via drill 0.5)
  Top 0.254: R16.2 v94,34
  Bottom 0.254: v94,34 91,34 85,28 85,21.5 84,20.5 84,19 85.5,17.5 87.1,17.5 88.13,16.47 88.13,15.3 86.18,13.35 J1.F1
1F2  (via drill 0.5)
  Top 0.254: R14.2 v93,36
  Bottom 0.254: J1.F2 86.11,15.89 83,19 83,20.5 84,21.5 84,28 92,36 v93,36
1F3  (via drill 0.5)
  Top 0.254: R12.2 v94,38
  Bottom 0.254: J1.F3 88.11,12.11 87,11 84,11 83,12 83,18 82,19 82,20.5 83,21.5 83,28 93,38 v94,38
1F6  (via drill 0.5)
  Top 0.254: v93,40 R10.2
  Bottom 0.254: J1.F6 91.92,15.92 96,20 96,39 95,40 v93,40
1G1
  Top 0.254: R23.2 101,32 99,30 99,26.79 97.44,25.23 97.44,18.77 98,18.21 98,14.89 J1.G1
1G2  (via drill 0.5)
  Top 0.254: v101,30 R22.2
  Bottom 0.254: J1.G2 100.81,20.61 102,21.8 102,29 v101,30
1G3  (via drill 0.5)
  Top 0.254: v100,28 R21.2
  Bottom 0.254: J1.G3 102.08,12.08 101,11 98,11 97,12 97,17 98,18 98,26 v100,28
1G6
  Top 0.254: J1.G6 105.89,16.11 104,18 99,18 98,19 98,25 99,26 R24.2
1H1  (via drill 0.5)
  Top 0.254: R32.2 v126,34
  Bottom 0.254: v126,34 123,34 113,24 113,21.5 112,20.5 112,19 113.5,17.5 115,17.5 116,16.5 116,15.33 114.02,13.35 J1.H1
1H2  (via drill 0.5)
  Top 0.254: R30.2 v125,36
  Bottom 0.254: J1.H2 114.11,15.89 111,19 111,20.5 112,21.5 112,24 124,36 v125,36
1H3  (via drill 0.5)
  Top 0.254: R28.2 v126,38
  Bottom 0.254: J1.H3 116.05,12.05 115,11 112,11 111,12 111,18 110,19 110,20.5 111,21.5 111,24 125,38 v126,38
1H6
  Top 0.254: J1.H6 121.97,18 122,18 128,24 128,38 126,40 R26.2
2A1  (via drill 0.5)
  Top 0.254: R33.2 v138,40
  Bottom 0.254: v138,40 141.5,40 150.49,31.01 J2.A1
2A2  (via drill 0.5)
  Top 0.254: R35.2 v139,38
  Bottom 0.254: J2.A2 149.22,27.78 v139,38
2A3  (via drill 0.5)
  Top 0.254: R34.2 v138,36
  Bottom 0.254: J2.A3 147.95,26.95 148,27 139,36 v138,36
2A6  (via drill 0.5)
  Top 0.254: R36.2 v139,34
  Bottom 0.254: v139,34 144.14,28.86 J2.A6
2B1
  Top 0.254: R49.2 163,26 164.46,24.54 J2.B1
2B2
  Top 0.254: J2.B2 163.24,20 165,20 165.65,20.65 165.65,25.35 163,28 R47.2
2B3  (via drill 0.5)
  Top 0.254: R45.2 v164,30
  Bottom 0.254: v164,30 161.92,27.92 J2.B3
2B6  (via drill 0.5)
  Top 0.254: R43.2 v163,32
  Bottom 0.254: v163,32 160,32 158.11,30.11 J2.B6
2C1  (via drill 0.5)
  Top 0.254: R51.2 v170,40
  Bottom 0.254: J2.C1 178.43,34.57 173,40 v170,40
2C2  (via drill 0.5)
  Top 0.254: R53.2 v171,38
  Bottom 0.254: v171,38 174,38 177.16,34.84 J2.C2
2C3  (via drill 0.5)
  Top 0.254: R52.2 v170,36
  Bottom 0.254: v170,36 172,36 175.89,32.11 J2.C3
2C6  (via drill 0.5)
  Top 0.254: R54.2 v171,34
  Bottom 0.254: J2.C6 172.69,19.95 174.54,21.8 174.54,30.46 v171,34
2D1
  Top 0.254: R65.2 193.76,23.85 J2.D1
2D2
  Top 0.254: J2.D2 192.95,19.95 195.1,22.1 195.1,26.66 R63.2
2D3  (via drill 0.5)
  Top 0.254: R61.2 v196,30
  Bottom 0.254: v196,30 189.86,23.86 J2.D3
2D6  (via drill 0.5)
  Top 0.254: R59.2 v195,32
  Bottom 0.254: v195,32 186.05,23.05 J2.D6
2E1
  Top 0.254: R41.2 139,32 135,28 135,15 136.65,13.35 J2.E1
2E2  (via drill 0.5)
  Top 0.254: R38.2 v139,30
  Bottom 0.254: v139,30 141,28 141,22.53 142.85,20.67 142.85,15.91 J2.E2
2E3  (via drill 0.5)
  Top 0.254: R37.2 v138,28
  Bottom 0.254: v138,28 140,26 140,15 139,14 139,12 140,11 143,11 144.14,12.14 J2.E3
2E6
  Top 0.254: R42.2 140,25.76 140,19 141,18 145.84,18 J2.E6
2F1  (via drill 0.5)
  Top 0.254: R50.2 v164,34
  Bottom 0.254: J2.F1 156.25,13.35 158.03,15.13 158.03,16.97 157,18 155,18 154,19 154,21 155,22 155,28 161,34 v164,34
2F2  (via drill 0.5)
  Top 0.254: R48.2 v163,36
  Bottom 0.254: v163,36 162,36 154,28 154,22 153,21 153,19 156.11,15.89 J2.F2
2F3  (via drill 0.5)
  Top 0.254: R46.2 v164,38
  Bottom 0.254: v164,38 163,38 153,28 153,22 152,21 152,19 153,18 153,12 154,11 157,11 158.11,12.11 J2.F3
2F6  (via drill 0.5)
  Top 0.254: v163,40 R44.2
  Bottom 0.254: v163,40 165,40 166,39 166,19.97 J2.F6
2G1
  Top 0.254: J2.G1 168,14.89 168,18.21 167.44,18.77 167.44,25.44 169,27 169,30 171,32 R57.2
2G2  (via drill 0.5)
  Top 0.254: R56.2 v171,30
  Bottom 0.254: v171,30 172,29 172,22 170.81,20.81 J2.G2
2G3  (via drill 0.5)
  Top 0.254: R55.2 v170,28
  Bottom 0.254: J2.G3 172.08,12.08 171,11 168,11 167,12 167,17 168,18 168,26 v170,28
2G6
  Top 0.254: R58.2 169,26 168,25 168,19 169,18 173.78,18 J2.G6
2H1  (via drill 0.5)
  Top 0.254: R66.2 v196,34
  Bottom 0.254: v196,34 193,34 183,24 183,22 182,21 182,19 183,18 185,18 186,17 186,15.23 184.12,13.35 J2.H1
2H2  (via drill 0.5)
  Top 0.254: R64.2 v195,36
  Bottom 0.254: v195,36 194,36 182,24 182,22 181,21 181,19 184.11,15.89 J2.H2
2H3  (via drill 0.5)
  Top 0.254: R62.2 v196,38
  Bottom 0.254: v196,38 195,38 181,24 181,22 180,21 180,19 181,18 181,12 182,11 185,11 186.05,12.05 J2.H3
2H6
  Top 0.254: R60.2 196,40 198,38 198,24.03 J2.H6
3A1  (via drill 0.5)
  Top 0.254: R70.2 v208,40
  Bottom 0.254: v208,40 212,40 220.49,31.51 J3.A1
3A2  (via drill 0.5)
  Top 0.254: R72.2 v209,38
  Bottom 0.254: v209,38 219.22,27.78 J3.A2
3A3  (via drill 0.5)
  Top 0.254: R71.2 v208,36
  Bottom 0.254: v208,36 209,36 217.95,27.05 J3.A3
3A6  (via drill 0.5)
  Top 0.254: R73.2 v209,34
  Bottom 0.254: v209,34 214.14,28.86 J3.A6
3B1
  Top 0.254: R84.2 233,26 234.46,24.54 J3.B1
3B2
  Top 0.254: R82.2 233,28 236,25 236,21 234.95,19.95 J3.B2
3B3  (via drill 0.5)
  Top 0.254: R80.2 v234,30
  Bottom 0.254: v234,30 231.92,27.92 J3.B3
3B6  (via drill 0.5)
  Top 0.254: R78.2 v233,32
  Bottom 0.254: v233,32 230,32 228.11,30.11 J3.B6
3C1  (via drill 0.5)
  Top 0.254: R86.2 v240,40
  Bottom 0.254: v240,40 243,40 248.43,34.57 J3.C1
3C2  (via drill 0.5)
  Top 0.254: R88.2 v241,38
  Bottom 0.254: v241,38 244,38 247.16,34.84 J3.C2
3C3  (via drill 0.5)
  Top 0.254: R87.2 v240,36
  Bottom 0.254: v240,36 242,36 245.89,32.11 J3.C3
3C6  (via drill 0.5)
  Top 0.254: R89.2 v241,34
  Bottom 0.254: v241,34 244.64,30.36 244.64,21.84 242.74,19.95 J3.C6
3D1
  Top 0.254: R100.2 263.76,23.85 J3.D1
3D2
  Top 0.254: R98.2 265,26.76 265,22 262.95,19.95 J3.D2
3D3  (via drill 0.5)
  Top 0.254: R96.2 v266,30
  Bottom 0.254: v266,30 259.86,23.86 J3.D3
3D6  (via drill 0.5)
  Top 0.254: R94.2 v265,32
  Bottom 0.254: v265,32 256.05,23.05 J3.D6
3E1
  Top 0.254: J3.E1 206.65,13.35 205,15 205,28 209,32 R76.2
3E2  (via drill 0.5)
  Top 0.254: R75.2 v209,30
  Bottom 0.254: v209,30 211,28 211,22.43 212.79,20.64 212.79,15.97 J3.E2
3E3  (via drill 0.5)
  Top 0.254: R74.2 v208,28
  Bottom 0.254: v208,28 210,26 210,15 209,14 209,12 209.5,11.5 213.5,11.5 214.14,12.14 J3.E3
3E6
  Top 0.254: J3.E6 215.84,18 211,18 210,19 210,25.76 R77.2
3F1  (via drill 0.5)
  Top 0.254: R85.2 v234,34
  Bottom 0.254: v234,34 231,34 225,28 225,22 224,21 224,19 225,18 227,18 228.03,16.97 228.03,15.23 226.15,13.35 J3.F1
3F2  (via drill 0.5)
  Top 0.254: R83.2 v233,36
  Bottom 0.254: v233,36 232,36 224,28 224,22 223,21 223,19 226.11,15.89 J3.F2
3F3  (via drill 0.5)
  Top 0.254: R81.2 v234,38
  Bottom 0.254: v234,38 233,38 223,28 223,22 222,21 222,19 223,18 223,12 224,11 227,11 228.11,12.11 J3.F3
3F6  (via drill 0.5)
  Top 0.254: R79.2 v233,40
  Bottom 0.254: v233,40 235,40 236,39 236,19.97 J3.F6
3G1
  Top 0.254: J3.G1 238,14.89 238,18.21 237.44,18.77 237.44,25.44 239,27 239,30 241,32 R92.2
3G2  (via drill 0.5)
  Top 0.254: R91.2 v241,30
  Bottom 0.254: v241,30 242,29 242,21.8 240.81,20.61 J3.G2
3G3  (via drill 0.5)
  Top 0.254: R90.2 v240,28
  Bottom 0.254: v240,28 238,26 238,12 239,11 241,11 242.08,12.08 J3.G3
3G6
  Top 0.254: J3.G6 243.78,18 239,18 238,19 238,25 239,26 R93.2
3H1  (via drill 0.5)
  Top 0.254: R101.2 v266,34
  Bottom 0.254: v266,34 263,34 253,24 253,22 252,21 252,19 253,18 255,18 256,17 256,15.2 254.15,13.35 J3.H1
3H2  (via drill 0.5)
  Top 0.254: R99.2 v265,36
  Bottom 0.254: v265,36 264,36 252,24 252,22 251,21 251,19 254.11,15.89 J3.H2
3H3  (via drill 0.5)
  Top 0.254: R97.2 v266,38
  Bottom 0.254: v266,38 265,38 251,24 251,22 250,21 250,19 251,18 251,12 252,11 255,11 256.05,12.05 J3.H3
3H6  (via drill 0.5)
  Top 0.254: R95.2 v266,40
  Bottom 0.254: v266,40 267,39 267,23 259.89,15.89 J3.H6
!INT  (via drill 0.5)
  Top 0.254: IC1.20 78.46,37.54 82,34 82,12 v85,9 | IC2.20 110.46,37.54 111,37 111,12 | 111,12 112.01,10.99 127.99,10.99 130,13 134,13 136,11 150.99,10.99 152,12 | IC4.20 180.46,37.54 181,37 v181,9 | IC3.20 148.46,37.54 152,34 152,12 | v222,9 222,34 218.46,37.54 IC5.20 | 251,12 251,37 250.46,37.54 IC6.20 | 251,12 253,10 267,10 271,14 J5.1 | 251,12 v248,9 | 152,12 v155,9 | v108,9 111,12
  Bottom 0.254: v248,9 v222,9 218,9 217,10 207,10 204,13 200,13 197,10 189,10 188,9 v181,9 v155,9 | v85,9 v108,9
!RESET  (via drill 0.5)
  Top 0.254: v251,40 248.3,40 IC6.18 | v219,40 216.3,40 IC5.18 | v181,40 178.3,40 IC4.18 | v149,40 146.3,40 IC3.18 | v111,40 108.3,40 IC2.18 | v79,40 76.3,40 IC1.18
  Bottom 0.254: J9.6 268.73,41.27 268,42 261,42 257,38 253,38 v251,40 249,42 232,42 230,40 v219,40 218,41 210,41 209,42 206,42 204,40 193,40 189,36 184,36 181,39 v181,40 179,42 161,42 157,38 151,38 v149,40 147,42 138,42 136,40 122,40 116,34 113,34 111,36 v111,40 109,42 90,42 87,39 87,35 85,33 82,33 79,36 v79,40
GND  (via drill 0.5)
  Bottom 0.254: v83,39 v83,36 | v115,39 v115,36
  pour Top: 272,0 arc90 275,3 275,47 arc90 272,50 3,50 arc90 0,47 0,3 arc90 3,0
GPA0-1
  Top 0.254: IC1.21 75.49,36.27 R1.1
GPA0-2
  Top 0.254: IC2.21 107.49,36.27 R17.1
GPA0-3
  Top 0.254: IC3.21 145.49,36.27 R33.1
GPA0-4
  Top 0.254: IC4.21 177.49,36.27 R51.1
GPA0-5
  Top 0.254: R70.1 215.49,36.27 IC5.21
GPA0-6
  Top 0.254: IC6.21 247.49,36.27 R86.1
GPA1-1
  Top 0.254: IC1.22 74.76,35 R3.1
GPA1-2
  Top 0.254: IC2.22 106.76,35 R19.1
GPA1-3
  Top 0.254: IC3.22 144.76,35 R35.1
GPA1-4
  Top 0.254: IC4.22 176.76,35 R53.1
GPA1-5
  Top 0.254: R72.1 214.76,35 IC5.22
GPA1-6
  Top 0.254: IC6.22 246.76,35 R88.1
GPA2-1
  Top 0.254: IC1.23 74.03,33.73 R2.1
GPA2-2
  Top 0.254: IC2.23 106.03,33.73 R18.1
GPA2-3
  Top 0.254: IC3.23 144.03,33.73 R34.1
GPA2-4
  Top 0.254: IC4.23 176.03,33.73 R52.1
GPA2-5
  Top 0.254: R71.1 214.03,33.73 IC5.23
GPA2-6
  Top 0.254: IC6.23 246.03,33.73 R87.1
GPA3-1
  Top 0.254: R4.1 73.3,32.46 IC1.24
GPA3-2
  Top 0.254: R20.1 105.3,32.46 IC2.24
GPA3-3
  Top 0.254: IC3.24 143.3,32.46 R36.1
GPA3-4
  Top 0.254: IC4.24 175.3,32.46 R54.1
GPA3-5
  Top 0.254: R73.1 213.3,32.46 IC5.24
GPA3-6
  Top 0.254: IC6.24 245.3,32.46 R89.1
GPA4-1
  Top 0.254: R7.1 72.57,31.19 IC1.25
GPA4-2
  Top 0.254: R23.1 104.57,31.19 IC2.25
GPA4-3
  Top 0.254: IC3.25 142.57,31.19 R41.1
GPA4-4
  Top 0.254: IC4.25 174.57,31.19 R57.1
GPA4-5
  Top 0.254: IC5.25 212.57,31.19 R76.1
GPA4-6
  Top 0.254: IC6.25 244.57,31.19 R92.1
GPA5-1
  Top 0.254: IC1.26 71.84,29.92 R6.1
GPA5-2
  Top 0.254: IC2.26 103.84,29.92 R22.1
GPA5-3
  Top 0.254: IC3.26 141.84,29.92 R38.1
GPA5-4
  Top 0.254: IC4.26 173.84,29.92 R56.1
GPA5-5
  Top 0.254: IC5.26 211.84,29.92 R75.1
GPA5-6
  Top 0.254: IC6.26 243.84,29.92 R91.1
GPA6-1
  Top 0.254: IC1.27 72.41,28.65 R5.1
GPA6-2
  Top 0.254: IC2.27 104.41,28.65 R21.1
GPA6-3
  Top 0.254: IC3.27 142.41,28.65 R37.1
GPA6-4
  Top 0.254: IC4.27 174.41,28.65 R55.1
GPA6-5
  Top 0.254: IC5.27 212.41,28.65 R74.1
GPA6-6
  Top 0.254: IC6.27 244.41,28.65 R90.1
GPA7-1
  Top 0.254: IC1.28 73.14,27.38 R8.1
GPA7-2
  Top 0.254: IC2.28 105.14,27.38 R24.1
GPA7-3
  Top 0.254: IC3.28 143.14,27.38 R42.1
GPA7-4
  Top 0.254: IC4.28 175.14,27.38 R58.1
GPA7-5
  Top 0.254: IC5.28 213.14,27.38 R77.1
GPA7-6
  Top 0.254: IC6.28 245.14,27.38 R93.1
GPB0-1
  Top 0.254: IC1.1 88.86,27.38 R15.1
GPB0-2
  Top 0.254: IC2.1 120.86,27.38 R31.1
GPB0-3
  Top 0.254: IC3.1 158.86,27.38 R49.1
GPB0-4
  Top 0.254: IC4.1 190.86,27.38 R65.1
GPB0-5
  Top 0.254: R84.1 228.86,27.38 IC5.1
GPB0-6
  Top 0.254: IC6.1 260.86,27.38 R100.1
GPB1-1
  Top 0.254: IC1.2 89.59,28.65 R13.1
GPB1-2
  Top 0.254: IC2.2 121.59,28.65 R29.1
GPB1-3
  Top 0.254: IC3.2 159.59,28.65 R47.1
GPB1-4
  Top 0.254: IC4.2 191.59,28.65 R63.1
GPB1-5
  Top 0.254: R82.1 229.59,28.65 IC5.2
GPB1-6
  Top 0.254: IC6.2 261.59,28.65 R98.1
GPB2-1
  Top 0.254: R11.1 90.16,29.92 IC1.3
GPB2-2
  Top 0.254: R27.1 122.16,29.92 IC2.3
GPB2-3
  Top 0.254: IC3.3 160.16,29.92 R45.1
GPB2-4
  Top 0.254: IC4.3 192.16,29.92 R61.1
GPB2-5
  Top 0.254: R80.1 225.86,30 IC5.3
GPB2-6
  Top 0.254: IC6.3 262.16,29.92 R96.1
GPB3-1
  Top 0.254: R9.1 89.43,31.19 IC1.4
GPB3-2
  Top 0.254: R25.1 121.43,31.19 IC2.4
GPB3-3
  Top 0.254: IC3.4 159.43,31.19 R43.1
GPB3-4
  Top 0.254: IC4.4 191.43,31.19 R59.1
GPB3-5
  Top 0.254: R78.1 229.43,31.19 IC5.4
GPB3-6
  Top 0.254: IC6.4 261.43,31.19 R94.1
GPB4-1
  Top 0.254: R16.1 88.7,32.46 IC1.5
GPB4-2
  Top 0.254: R32.1 120.7,32.46 IC2.5
GPB4-3
  Top 0.254: IC3.5 158.7,32.46 R50.1
GPB4-4
  Top 0.254: IC4.5 190.7,32.46 R66.1
GPB4-5
  Top 0.254: R85.1 228.7,32.46 IC5.5
GPB4-6
  Top 0.254: IC6.5 260.7,32.46 R101.1
GPB5-1
  Top 0.254: IC1.6 87.97,33.73 R14.1
GPB5-2
  Top 0.254: IC2.6 119.97,33.73 R30.1
GPB5-3
  Top 0.254: IC3.6 157.97,33.73 R48.1
GPB5-4
  Top 0.254: IC4.6 189.97,33.73 R64.1
GPB5-5
  Top 0.254: R83.1 227.97,33.73 IC5.6
GPB5-6
  Top 0.254: IC6.6 259.97,33.73 R99.1
GPB6-1
  Top 0.254: IC1.7 87.24,35 R12.1
GPB6-2
  Top 0.254: IC2.7 119.24,35 R28.1
GPB6-3
  Top 0.254: IC3.7 157.24,35 R46.1
GPB6-4
  Top 0.254: IC4.7 189.24,35 R62.1
GPB6-5
  Top 0.254: R81.1 227.24,35 IC5.7
GPB6-6
  Top 0.254: IC6.7 259.24,35 R97.1
GPB7-1
  Top 0.254: IC1.8 86.51,36.27 R10.1
GPB7-2
  Top 0.254: IC2.8 118.51,36.27 R26.1
GPB7-3
  Top 0.254: IC3.8 156.51,36.27 R44.1
GPB7-4
  Top 0.254: IC4.8 189.27,36.27 191,38 191,39.5 191.5,40 R60.1
GPB7-5
  Top 0.254: R79.1 226.51,36.27 IC5.8
GPB7-6
  Top 0.254: IC6.8 258.51,36.27 R95.1
N$1
  Top 0.254: SJ2.1 191,48.26 R68.2
N$2
  Top 0.254: SJ3.1 195,48.26 R69.2
N$3
  Bottom 0.508: J7.1 38.09,40 31,40 30,39 30,12.9 J6.1
N$4
  Top 0.508: J7.2 39.17,24.18 32.83,17.82 J6.2
N$5
  Bottom 0.508: J7.3 37.91,20.91 36.63,19.64 36.63,13.36 37.91,12.09 37.91,9.9 37,9 35,9 34.09,9.9 J6.3
N$6
  Bottom 0.508: J7.4 36.63,23.64 35.37,22.36 J6.4
N$9
  Bottom 0.508: J7.5 35.37,23.51 34.09,22.24 34.09,13.36 36.11,11.35 J6.5
N$10
  Top 0.508: J6.6 37.91,16.91 41,20 41,35.08 39.7,36.38 35.37,36.38 J7.6
N$11
  Top 0.508: J6.7 39.17,16.18 42,19 42,39 41,40 35.17,40 J7.7
N$12
  Top 0.508: J7.8 30,33.55 30,10 31,9 41,9 42,10 42,12.34 J6.8
N$13
  Top 0.254: LED1.A 53.73,8.49 R67.1
N$18
  Top 1.27: D1.A 17.15,12.15 15.7,10.7 J8.PWR
  Bottom 1.27: J4.2 13,35.5 J8.PWR
SCL  (via drill 0.5, 0.61)
  Top 0.254: v185,41 185.35,41.35 IC4.12 188.35,41.35 190,43 197,43 198,42 211,42 v212,43 | v153,41 153.35,41.35 IC3.12 | v115,41 115.35,41.35 IC2.12 | IC1.12 83.35,41.35 v83,41 | R68.1 187.74,46.74 v187,46 | v230,43 228.35,41.35 IC5.12 | v255,41 255.35,41.35 IC6.12 260.35,41.35 262,43 267,43 273,37 273,33.19 J9.1
  Bottom 0.254: v83,41 85,43 113,43 v115,41 135.5,41 137.5,43 151,43 v153,41 155,43 183,43 v185,41 187,43 v187,46 | v212,43 v230,43 253,43 v255,41
SDA  (via drill 0.5, 0.61)
  Top 0.254: v185,43 185.38,42.62 IC4.13 188.62,42.62 190,44 197,44 197.5,44.5 | v153,43 153.38,42.62 IC3.13 | v115,43 115.38,42.62 IC2.13 | IC1.13 83.38,42.62 v83,43 | R69.1 197.5,44.5 | 197.5,44.5 199,43 208,43 211,46 v213,46 | v229,46 229,44 227.62,42.62 IC5.13 | v255,44 256.38,42.62 IC6.13 260.62,42.62 262,44 267,44 273.56,37.44 273.56,30.56 273,30 270.19,30 J9.2
  Bottom 0.254: v185,43 184,44 154,44 v153,43 152,44 137,44 135,42 116,42 v115,43 114,44 84,44 v83,43 | v213,46 v229,46 253,46 v255,44
VCC  (via drill 0.5)
  Top 0.254: 179.99,43.89 IC4.15 | IC4.15 IC4.16 | 179.99,43.89 181,42.88 181,42 v184,39 185.46,37.54 IC4.9 189.04,37.54 190,38.5 190,40 191.35,41.35 IC5.17 219.65,41.35 | IC1.9 82.46,37.54 81,39 81,45 81.9,45.9 C1.1 92.6,45.9 94.61,43.89 IC2.15 110.99,43.89 111.92,42.96 111.92,40.08 114.46,37.54 IC2.9 118.54,37.54 121,40 121,41 122,42 | SJ2.2 191.74,46 v193,46 194.26,46 SJ3.2 | 122,42 142,42 142.62,42.62 IC3.16 149.62,42.62 150.92,41.32 150.92,40.08 153.46,37.54 IC3.9 156.54,37.54 159,40 C3.1 159.21,43.89 IC4.15 | 122,42 121,43 C2.1 | C4.1 181.6,45.5 179.99,43.89 | 220.1,46 C5.1 | 220.1,46 225,46 227,48 247,48 248.22,46.78 IC6.15 250.89,43.89 251,44 | J9.5 265.81,42 262,42 261,41 261,40 258.54,37.54 IC6.9 253.46,37.54 252,39 252,41 251,42 | C6.1 252.1,45.1 251,44 | 251,44 251,42 | 251,42 250.35,41.35 IC6.17 | IC5.9 223.46,37.54 219.65,41.35 | 219.65,41.35 220.1,41.8 220.1,46
  Bottom 0.254: v193,46 193,45 187,39 v184,39
VIN  (via drill 0.5)
  Top 0.254: 21.15,6 v21,6 | D1.C v23,6 | R67.2 55.76,10.24 v55,11
  Top 0.813: C8.+ v202,23 v202,21 v202,19 | C7.+ v132,23 v132,21 v132,19
  other vias: 21,4 22,5 25,6 24,5 23,4 25,4
  pour Bottom: 272,0 arc90 275,3 275,47 arc90 272,50 3,50 arc90 0,47 0,3 arc90 3,0
(copper drawn outside any net)
  shapes: Top area x1

### Text on the board
tPlace: v2.1 | + | - | www.superhouse.tv/i2crj45x24 | SKU: I2CRJ45X24 | 0x20 | 0x21 | 0x22 | 0x23 | 0x24 | 0x25 | I2C P/U | 12Vdc | I2C-BREAKOUT | RJ45 Pinout | Super / House | www.superhouse.tv | MCP23017 | MCP23017 | MCP23017 | MCP23017 | MCP23017 | MCP23017 | Ethernet / Pass- / through | 1: Data 1 / 2: Data 2 / 3: Data 3 / 4: VIN / 5: VIN / 6: Data 4 / 7: GND / 8: GND | !INT | 24 Channel / I2C RJ45 / Breakout | by Jon Oxer | 1K in series with / each data line | A | 12Vdc
bPlace: !RST | VCC | GND | VIN | Copyright 2019-2020 SuperHouse Automation Pty Ltd / / Released under the terms / of the TAPR Open Hardware / License: www.tapr.org/OHL | SDA | SCL